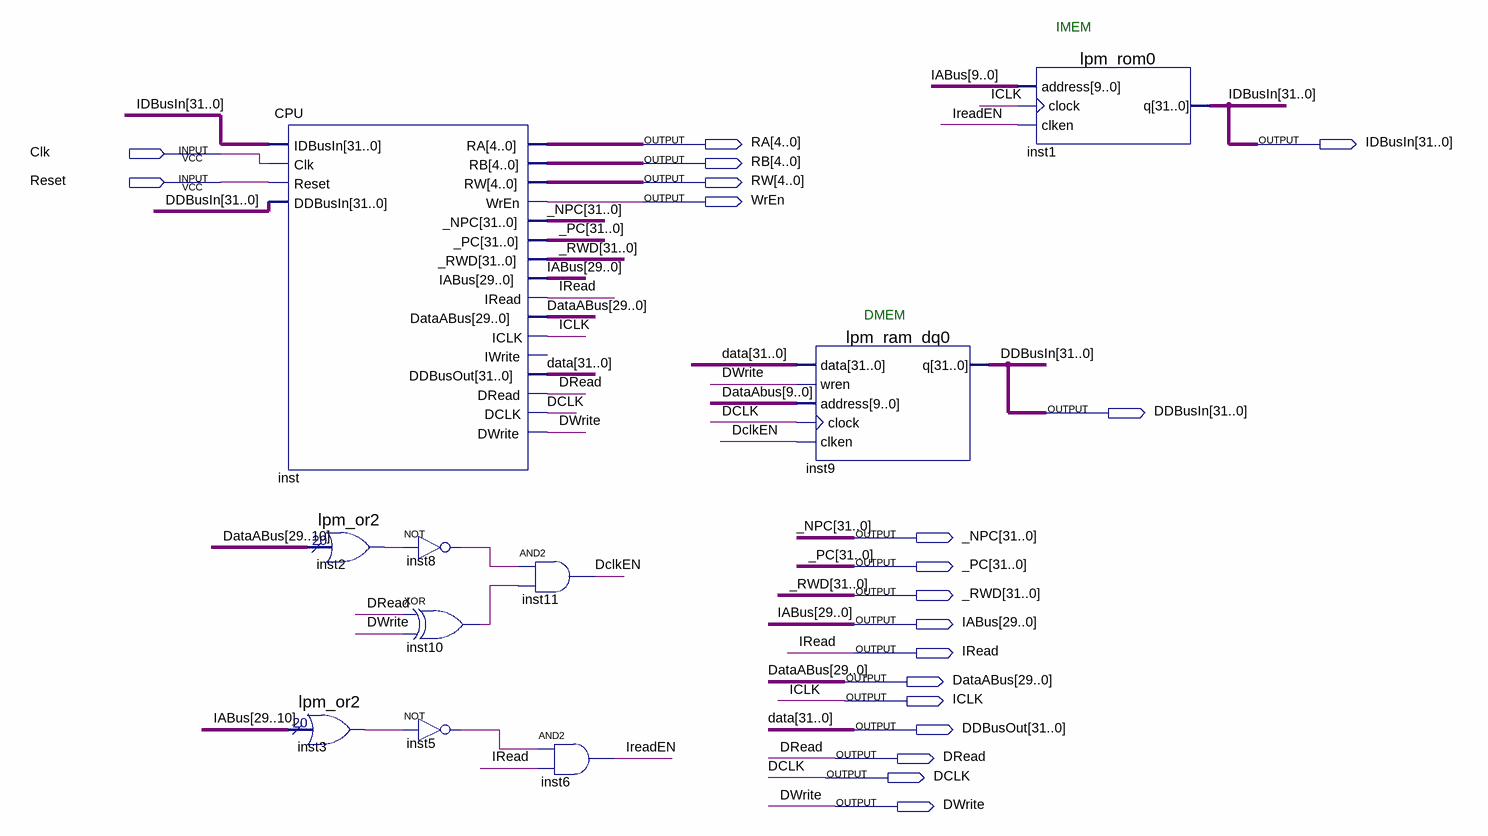
[diagram p0: schematic sheet]
// Quartus schematic Computer.bdf as structural Verilog: 10 symbols, 19 pins
module Computer (
  input  Clk,
  input  Reset,
  output [4:0] RA,
  output [31:0] IDBusIn,
  output [4:0] RB,
  output [4:0] RW,
  output WrEn,
  output [31:0] DDBusIn,
  output [31:0] _NPC,
  output [31:0] _PC,
  output [31:0] _RWD,
  output [29:0] IABus,
  output IRead,
  output [29:0] DataABus,
  output ICLK,
  output [31:0] DDBusOut,
  output DRead,
  output DCLK,
  output DWrite
);

  wire DclkEN, inst2_result, inst3_result, inst5_out, inst8_out, inst10_out, IreadEN;

  CPU inst (
    .IDBusIn(IDBusIn), .Clk(Clk), .Reset(Reset), .DDBusIn(DDBusIn), .RA(RA), .RB(RB), .RW(RW), .WrEn(WrEn),
    ._NPC(_NPC), ._PC(_PC), ._RWD(_RWD), .IABus(IABus), .IRead(IRead), .DataABus(DataABus), .ICLK(ICLK),
    .DDBusOut(DDBusOut), .DRead(DRead), .DCLK(DCLK), .DWrite(DWrite));  // open: IWrite
  lpm_or2 inst2 (.data(DataABus[29:10]), .result(inst2_result));
  lpm_or2 inst3 (.data(IABus[29:10]), .result(inst3_result));
  not inst8 (inst8_out, inst2_result);
  xor inst10 (inst10_out, DRead, DWrite);
  not inst5 (inst5_out, inst3_result);
  and inst11 (DclkEN, inst8_out, inst10_out);
  and inst6 (IreadEN, inst5_out, IRead);
  lpm_ram_dq0 inst9 (
    .data(DDBusOut), .wren(DWrite), .address(DataABus[9:0]), .clock(DCLK), .clken(DclkEN), .q(DDBusIn));
  lpm_rom0 inst1 (.address(IABus[9:0]), .clock(ICLK), .clken(IreadEN), .q(IDBusIn));

  // Other names for the same wires on the sheet: data[31:0] = DDBusOut

  // Notes on the sheet:
  //   IMEM
  //   DMEM
endmodule
